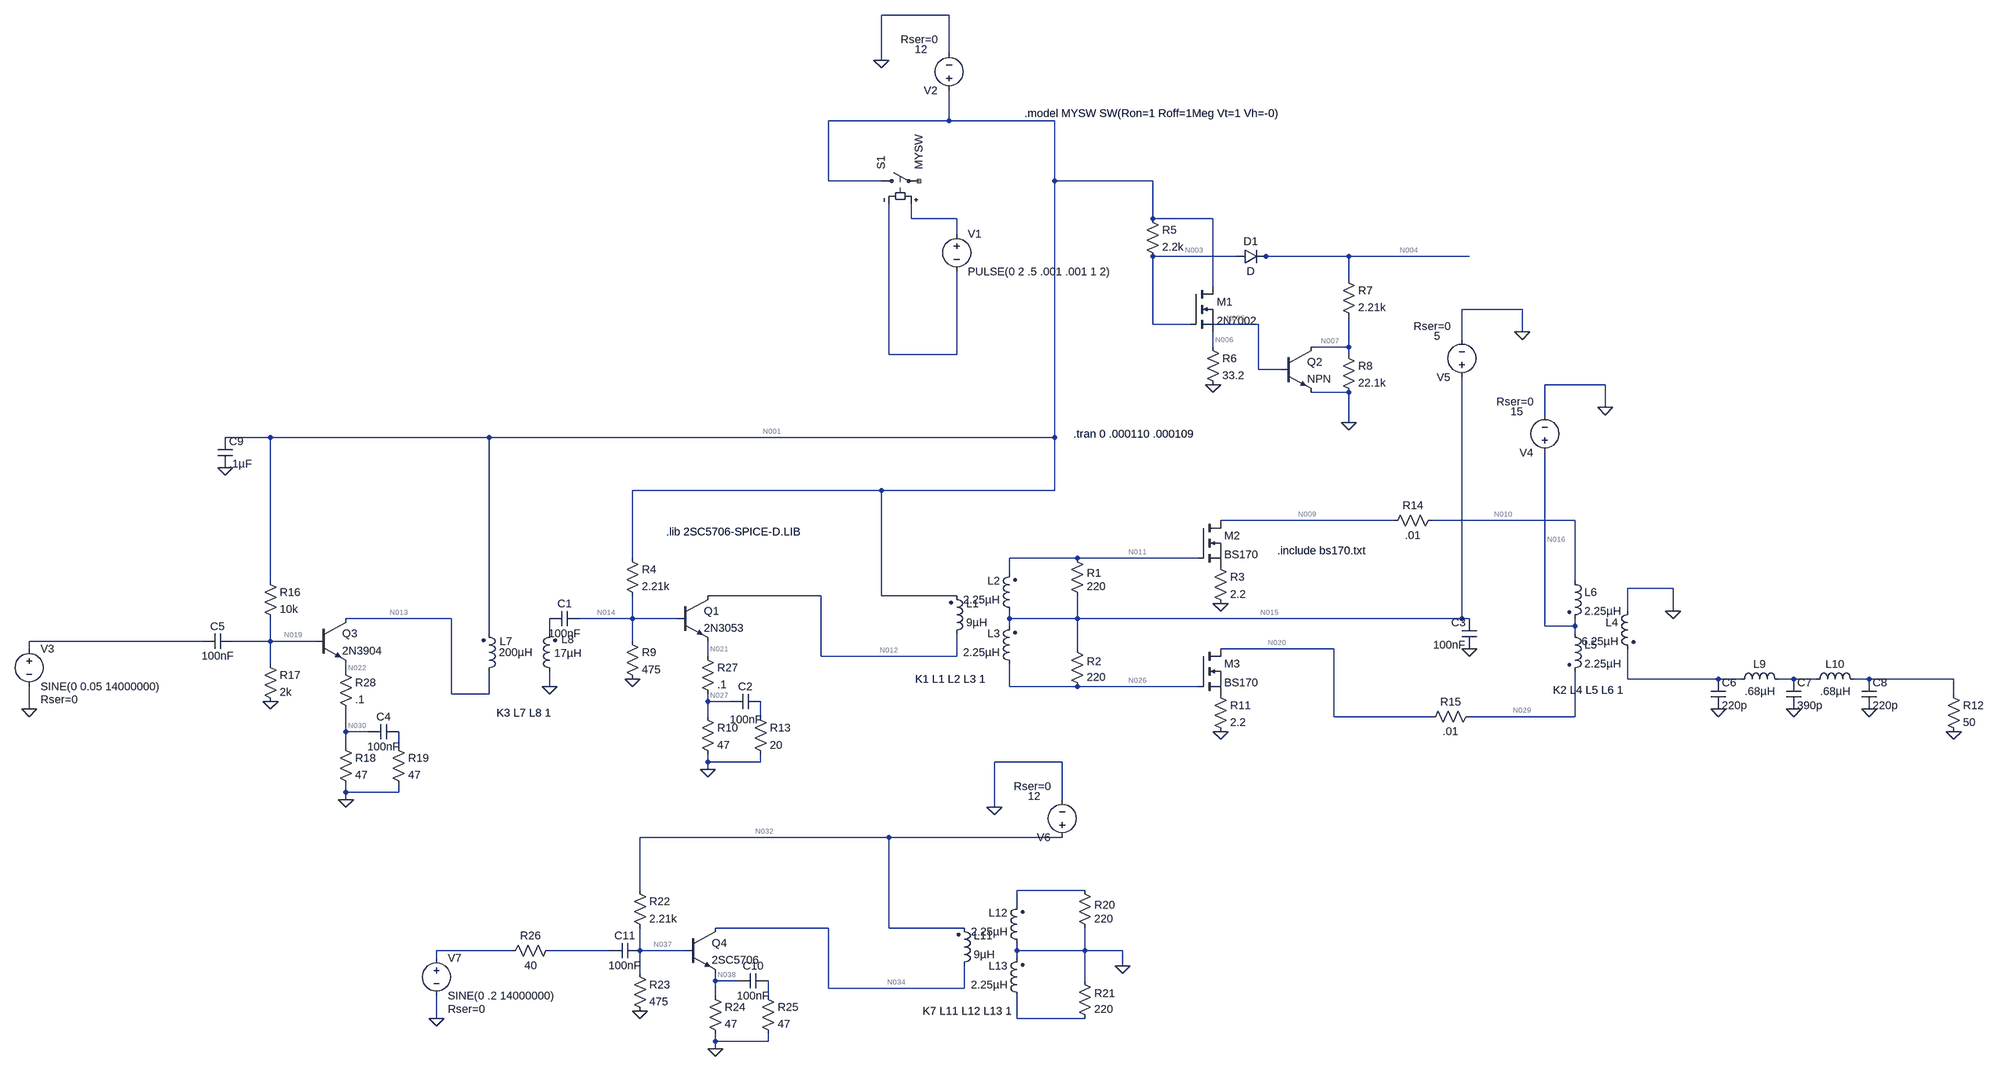
[diagram p0: schematic Transmit Switch Ensemble.asc]
Transmit Switch Ensemble.asc, the LTspice schematic file:
Version 4
SHEET 1 3352 1348
WIRE -416 -992 -560 -992
WIRE -416 -912 -416 -992
WIRE -560 -896 -560 -992
WIRE -416 -768 -416 -832
WIRE -416 -768 -672 -768
WIRE -192 -768 -416 -768
WIRE -672 -640 -672 -768
WIRE -560 -640 -672 -640
WIRE -192 -640 -192 -768
WIRE 16 -640 -192 -640
WIRE -496 -560 -496 -592
WIRE -400 -560 -496 -560
WIRE 16 -560 16 -640
WIRE 144 -560 16 -560
WIRE -400 -528 -400 -560
WIRE 192 -480 16 -480
WIRE 256 -480 240 -480
WIRE 432 -480 256 -480
WIRE 688 -480 432 -480
WIRE 432 -432 432 -480
WIRE 144 -416 144 -560
WIRE 800 -368 672 -368
WIRE 16 -336 16 -480
WIRE 96 -336 16 -336
WIRE 240 -336 144 -336
WIRE 800 -320 800 -368
WIRE 672 -304 672 -368
WIRE 144 -288 144 -320
WIRE 432 -288 432 -352
WIRE 432 -288 352 -288
WIRE -544 -272 -544 -592
WIRE -400 -272 -400 -448
WIRE -400 -272 -544 -272
WIRE 432 -272 432 -288
WIRE 240 -240 240 -336
WIRE 288 -240 240 -240
WIRE 976 -208 848 -208
WIRE 432 -192 352 -192
WIRE 976 -160 976 -208
WIRE 848 -144 848 -208
WIRE 432 -128 432 -192
WIRE -1856 -96 -1952 -96
WIRE -1392 -96 -1856 -96
WIRE -192 -96 -192 -640
WIRE -192 -96 -1392 -96
WIRE -560 16 -1088 16
WIRE -192 16 -192 -96
WIRE -192 16 -560 16
WIRE 528 80 160 80
WIRE 912 80 608 80
WIRE -1088 160 -1088 16
WIRE -144 160 -288 160
WIRE 112 160 -144 160
WIRE -288 192 -288 160
WIRE -1856 208 -1856 -96
WIRE 912 208 912 80
WIRE 1120 224 1024 224
WIRE -688 240 -928 240
WIRE -560 240 -560 16
WIRE -400 240 -560 240
WIRE 1024 272 1024 224
WIRE 1120 272 1120 224
WIRE -1472 288 -1696 288
WIRE -1088 288 -1088 240
WIRE -1088 288 -1200 288
WIRE -992 288 -1088 288
WIRE -288 288 -288 272
WIRE -144 288 -144 240
WIRE -144 288 -288 288
WIRE 672 288 672 -224
WIRE 672 288 -144 288
WIRE 688 288 672 288
WIRE -288 304 -288 288
WIRE 848 304 848 -64
WIRE 912 304 912 288
WIRE 912 304 848 304
WIRE -1392 320 -1392 -96
WIRE -1264 320 -1264 288
WIRE 912 320 912 304
WIRE -2000 336 -2368 336
WIRE -1856 336 -1856 288
WIRE -1856 336 -1936 336
WIRE -1760 336 -1856 336
WIRE -1088 336 -1088 288
WIRE -2368 352 -2368 336
WIRE -144 352 -144 288
WIRE 400 352 160 352
WIRE -928 368 -928 336
WIRE -688 368 -688 240
WIRE -400 368 -400 320
WIRE -400 368 -688 368
WIRE -1856 384 -1856 336
WIRE -1696 400 -1696 384
WIRE 1024 416 1024 352
WIRE 1216 416 1024 416
WIRE 1264 416 1216 416
WIRE 1376 416 1344 416
WIRE 1424 416 1376 416
WIRE 1536 416 1504 416
WIRE 1904 416 1536 416
WIRE -1264 432 -1264 400
WIRE -288 432 -288 384
WIRE -144 432 -288 432
WIRE 112 432 -144 432
WIRE -1472 448 -1472 288
WIRE -1392 448 -1392 400
WIRE -1392 448 -1472 448
WIRE 1904 448 1904 416
WIRE -928 464 -928 448
WIRE -880 464 -928 464
WIRE -2368 480 -2368 432
WIRE -928 496 -928 464
WIRE -816 496 -816 464
WIRE 400 496 400 352
WIRE 608 496 400 496
WIRE 912 496 912 400
WIRE 912 496 688 496
WIRE -1696 528 -1696 480
WIRE -1648 528 -1696 528
WIRE -1696 560 -1696 528
WIRE -1584 560 -1584 528
WIRE -928 592 -928 576
WIRE -816 592 -816 576
WIRE -816 592 -928 592
WIRE -176 592 -320 592
WIRE -928 608 -928 592
WIRE -1696 656 -1696 640
WIRE -1584 656 -1584 640
WIRE -1584 656 -1696 656
WIRE -1696 672 -1696 656
WIRE -176 672 -176 592
WIRE -320 688 -320 592
WIRE -544 752 -1072 752
WIRE -176 752 -544 752
WIRE -1072 896 -1072 752
WIRE -128 896 -272 896
WIRE -272 928 -272 896
WIRE -672 976 -912 976
WIRE -544 976 -544 752
WIRE -384 976 -544 976
WIRE -1344 1024 -1504 1024
WIRE -1136 1024 -1264 1024
WIRE -1072 1024 -1072 976
WIRE -976 1024 -1072 1024
WIRE -272 1024 -272 1008
WIRE -128 1024 -128 976
WIRE -128 1024 -272 1024
WIRE -48 1024 -128 1024
WIRE -1504 1040 -1504 1024
WIRE -272 1040 -272 1024
WIRE -48 1056 -48 1024
WIRE -1072 1072 -1072 1024
WIRE -912 1088 -912 1072
WIRE -864 1088 -912 1088
WIRE -128 1088 -128 1024
WIRE -672 1104 -672 976
WIRE -384 1104 -384 1056
WIRE -384 1104 -672 1104
WIRE -912 1120 -912 1088
WIRE -800 1120 -800 1088
WIRE -1504 1168 -1504 1120
WIRE -272 1168 -272 1120
WIRE -128 1168 -272 1168
WIRE -912 1216 -912 1200
WIRE -800 1216 -800 1200
WIRE -800 1216 -912 1216
WIRE -912 1232 -912 1216
FLAG -560 -896 0
FLAG 144 -208 0
FLAG 432 -128 0
FLAG -2368 480 0
FLAG -1088 416 0
FLAG -928 608 0
FLAG 160 256 0
FLAG 160 528 0
FLAG 1120 272 0
FLAG 1904 528 0
FLAG 976 -160 0
FLAG 688 352 0
FLAG 800 -320 0
FLAG -1856 464 0
FLAG -1696 672 0
FLAG -1264 432 0
FLAG 1216 480 0
FLAG 1376 480 0
FLAG 1536 480 0
FLAG -1952 -32 0
FLAG -1072 1152 0
FLAG -912 1232 0
FLAG -320 688 0
FLAG -1504 1168 0
FLAG -48 1056 0
SYMBOL voltage -416 -816 R180
WINDOW 123 0 0 Left 0
WINDOW 39 24 124 Left 2
WINDOW 3 46 103 Left 2
SYMATTR SpiceLine Rser=0
SYMATTR Value 12
SYMATTR InstName V2
SYMBOL diode 192 -464 R270
WINDOW 0 32 32 VTop 2
WINDOW 3 0 32 VBottom 2
SYMATTR InstName D1
SYMBOL nmos 96 -416 R0
SYMATTR InstName M1
SYMATTR Value 2N7002
SYMBOL res 0 -576 R0
SYMATTR InstName R5
SYMATTR Value 2.2k
SYMBOL res 128 -304 R0
SYMATTR InstName R6
SYMATTR Value 33.2
SYMBOL res 416 -448 R0
SYMATTR InstName R7
SYMATTR Value 2.21k
SYMBOL res 416 -288 R0
SYMATTR InstName R8
SYMATTR Value 22.1k
SYMBOL npn 288 -288 R0
SYMATTR InstName Q2
SYMBOL sw -576 -640 R270
SYMATTR InstName S1
SYMATTR Value MYSW
SYMBOL voltage -400 -544 R0
WINDOW 123 0 0 Left 0
WINDOW 39 0 0 Left 0
SYMATTR InstName V1
SYMATTR Value PULSE(0 2 .5 .001 .001 1 2)
SYMBOL voltage -2368 336 R0
WINDOW 123 0 0 Left 0
WINDOW 39 24 124 Left 2
SYMATTR SpiceLine Rser=0
SYMATTR InstName V3
SYMATTR Value SINE(0 0.05 14000000)
SYMBOL ind2 -416 336 M180
WINDOW 0 36 80 Left 2
WINDOW 3 36 40 Left 2
SYMATTR InstName L1
SYMATTR Value 9µH
SYMATTR Type ind
SYMBOL ind2 -272 288 R180
WINDOW 0 36 80 Left 2
WINDOW 3 36 40 Left 2
SYMATTR InstName L2
SYMATTR Value 2.25µH
SYMATTR Type ind
SYMBOL ind2 -272 400 R180
WINDOW 0 36 80 Left 2
WINDOW 3 36 40 Left 2
SYMATTR InstName L3
SYMATTR Value 2.25µH
SYMATTR Type ind
SYMBOL res -160 144 R0
WINDOW 0 36 47 Left 2
SYMATTR InstName R1
SYMATTR Value 220
SYMBOL res -160 336 R0
WINDOW 0 36 43 Left 2
SYMATTR InstName R2
SYMATTR Value 220
SYMBOL res -1104 144 R0
SYMATTR InstName R4
SYMATTR Value 2.21k
SYMBOL res -1104 320 R0
SYMATTR InstName R9
SYMATTR Value 475
SYMBOL cap -1200 272 R90
WINDOW 0 0 32 VBottom 2
WINDOW 3 32 32 VTop 2
SYMATTR InstName C1
SYMATTR Value 100nF
SYMBOL res -944 480 R0
SYMATTR InstName R10
SYMATTR Value 47
SYMBOL nmos 112 80 R0
SYMATTR InstName M2
SYMATTR Value BS170
SYMATTR Prefix X
SYMBOL nmos 112 352 R0
SYMATTR InstName M3
SYMATTR Value BS170
SYMATTR Prefix X
SYMBOL res 144 160 R0
SYMATTR InstName R3
SYMATTR Value 2.2
SYMBOL res 144 432 R0
SYMATTR InstName R11
SYMATTR Value 2.2
SYMBOL ind2 1040 256 M0
SYMATTR InstName L4
SYMATTR Value 6.25µH
SYMATTR Type ind
SYMBOL ind2 896 304 R0
SYMATTR InstName L5
SYMATTR Value 2.25µH
SYMATTR Type ind
SYMBOL ind2 896 192 R0
SYMATTR InstName L6
SYMATTR Value 2.25µH
SYMATTR Type ind
SYMBOL res 1888 432 R0
SYMATTR InstName R12
SYMATTR Value 50
SYMBOL voltage 848 -48 R180
WINDOW 123 0 0 Left 0
WINDOW 39 24 124 Left 2
WINDOW 3 46 103 Left 2
SYMATTR SpiceLine Rser=0
SYMATTR Value 15
SYMATTR InstName V4
SYMBOL cap 704 352 R180
WINDOW 0 24 56 Left 2
WINDOW 3 24 8 Left 2
SYMATTR InstName C3
SYMATTR Value 100nF
SYMBOL cap -816 448 R90
WINDOW 0 0 32 VBottom 2
WINDOW 3 39 31 VTop 2
SYMATTR InstName C2
SYMATTR Value 100nF
SYMBOL res -832 480 R0
SYMATTR InstName R13
SYMATTR Value 20
SYMBOL voltage 672 -208 R180
WINDOW 123 0 0 Left 0
WINDOW 39 24 124 Left 2
WINDOW 3 46 103 Left 2
SYMATTR SpiceLine Rser=0
SYMATTR Value 5
SYMATTR InstName V5
SYMBOL npn -992 240 R0
SYMATTR InstName Q1
SYMATTR Value 2N3053
SYMBOL res 624 64 R90
WINDOW 0 0 56 VBottom 2
WINDOW 3 32 56 VTop 2
SYMATTR InstName R14
SYMATTR Value .01
SYMBOL res 704 480 R90
WINDOW 0 0 56 VBottom 2
WINDOW 3 32 56 VTop 2
SYMATTR InstName R15
SYMATTR Value .01
SYMBOL res -1872 192 R0
SYMATTR InstName R16
SYMATTR Value 10k
SYMBOL res -1872 368 R0
SYMATTR InstName R17
SYMATTR Value 2k
SYMBOL res -1712 544 R0
SYMATTR InstName R18
SYMATTR Value 47
SYMBOL cap -1584 512 R90
WINDOW 0 0 32 VBottom 2
WINDOW 3 32 32 VTop 2
SYMATTR InstName C4
SYMATTR Value 100nF
SYMBOL res -1600 544 R0
SYMATTR InstName R19
SYMATTR Value 47
SYMBOL npn -1760 288 R0
SYMATTR InstName Q3
SYMATTR Value 2N3904
SYMBOL cap -1936 320 R90
WINDOW 0 0 32 VBottom 2
WINDOW 3 32 32 VTop 2
SYMATTR InstName C5
SYMATTR Value 100nF
SYMBOL ind2 -1408 416 M180
WINDOW 0 38 80 Left 2
WINDOW 3 37 56 Left 2
SYMATTR InstName L7
SYMATTR Value 200µH
SYMATTR Type ind
SYMBOL ind2 -1248 416 R180
WINDOW 0 -36 84 Left 2
WINDOW 3 -52 55 Left 2
SYMATTR InstName L8
SYMATTR Value 17µH
SYMATTR Type ind
SYMBOL cap 1200 416 R0
SYMATTR InstName C6
SYMATTR Value 220p
SYMBOL cap 1360 416 R0
SYMATTR InstName C7
SYMATTR Value 390p
SYMBOL cap 1520 416 R0
SYMATTR InstName C8
SYMATTR Value 220p
SYMBOL ind 1248 432 R270
WINDOW 0 32 56 VTop 2
WINDOW 3 5 56 VBottom 2
SYMATTR InstName L9
SYMATTR Value .68µH
SYMBOL ind 1408 432 R270
WINDOW 0 32 56 VTop 2
WINDOW 3 5 56 VBottom 2
SYMATTR InstName L10
SYMATTR Value .68µH
SYMBOL cap -1968 -96 R0
SYMATTR InstName C9
SYMATTR Value .1µF
SYMBOL ind2 -400 1072 M180
WINDOW 0 36 80 Left 2
WINDOW 3 36 40 Left 2
SYMATTR InstName L11
SYMATTR Value 9µH
SYMATTR Type ind
SYMBOL ind2 -256 1024 R180
WINDOW 0 36 80 Left 2
WINDOW 3 36 40 Left 2
SYMATTR InstName L12
SYMATTR Value 2.25µH
SYMATTR Type ind
SYMBOL ind2 -256 1136 R180
WINDOW 0 36 80 Left 2
WINDOW 3 36 40 Left 2
SYMATTR InstName L13
SYMATTR Value 2.25µH
SYMATTR Type ind
SYMBOL res -144 880 R0
WINDOW 0 36 47 Left 2
SYMATTR InstName R20
SYMATTR Value 220
SYMBOL res -144 1072 R0
WINDOW 0 36 43 Left 2
SYMATTR InstName R21
SYMATTR Value 220
SYMBOL res -1088 880 R0
SYMATTR InstName R22
SYMATTR Value 2.21k
SYMBOL res -1088 1056 R0
SYMATTR InstName R23
SYMATTR Value 475
SYMBOL res -928 1104 R0
SYMATTR InstName R24
SYMATTR Value 47
SYMBOL cap -800 1072 R90
WINDOW 0 0 32 VBottom 2
WINDOW 3 32 32 VTop 2
SYMATTR InstName C10
SYMATTR Value 100nF
SYMBOL res -816 1104 R0
SYMATTR InstName R25
SYMATTR Value 47
SYMBOL npn -976 976 R0
SYMATTR InstName Q4
SYMATTR Value 2SC5706
SYMBOL voltage -176 768 R180
WINDOW 123 0 0 Left 0
WINDOW 39 24 124 Left 2
WINDOW 3 46 103 Left 2
SYMATTR SpiceLine Rser=0
SYMATTR Value 12
SYMATTR InstName V6
SYMBOL voltage -1504 1024 R0
WINDOW 123 0 0 Left 0
WINDOW 39 24 124 Left 2
SYMATTR SpiceLine Rser=0
SYMATTR InstName V7
SYMATTR Value SINE(0 .2 14000000)
SYMBOL cap -1072 1008 R90
WINDOW 0 0 32 VBottom 2
WINDOW 3 32 32 VTop 2
SYMATTR InstName C11
SYMATTR Value 100nF
SYMBOL res -1248 1008 R90
WINDOW 0 0 56 VBottom 2
WINDOW 3 32 56 VTop 2
SYMATTR InstName R26
SYMATTR Value 40
SYMBOL res -944 352 R0
SYMATTR InstName R27
SYMATTR Value .1
SYMBOL res -1712 384 R0
SYMATTR InstName R28
SYMATTR Value .1
TEXT -152 -104 Left 2 !.tran 0 .000110 .000109
TEXT -256 -784 Left 2 !.model MYSW SW(Ron=1 Roff=1Meg Vt=1 Vh=-0)
TEXT -488 416 Left 2 !K1 L1 L2 L3 1
TEXT 1016 440 Right 2 !K2 L4 L5 L6 1
TEXT 280 144 Left 2 !.include bs170.txt
TEXT -1016 104 Left 2 !.lib 2SC5706-SPICE-D.LIB
TEXT -1376 488 Left 2 !K3 L7 L8 1
TEXT -472 1152 Left 2 !K7 L11 L12 L13 1

The netlist it stands for:
* Transmit Switch Ensemble.asc
V2 N001 0 12 Rser=0
D1 N003 N004 D
M1 N001 N003 N006 N006 2N7002
R5 N001 N003 2.2k
R6 N006 0 33.2
R7 N004 N007 2.21k
R8 N007 0 22.1k
Q2 N007 N005 0 0 NPN
S1 N001 NC_01 N002 N008 MYSW
V1 N002 N008 PULSE(0 2 .5 .001 .001 1 2)
V3 N018 0 SINE(0 0.05 14000000) Rser=0
L1 N012 N001 9µH
L2 N015 N011 2.25µH
L3 N026 N015 2.25µH
R1 N011 N015 220
R2 N015 N026 220
R4 N001 N014 2.21k
R9 N014 0 475
C1 N014 N017 100nF
R10 N027 0 47
XM2 N009 N011 P001 BS170  ; pins D G S
XM3 N020 N026 P002 BS170  ; pins D G S
R3 P001 0 2.2
R11 P002 0 2.2
L4 0 N023 6.25µH
L5 N016 N029 2.25µH
L6 N010 N016 2.25µH
R12 N025 0 50
V4 N016 0 15 Rser=0
C3 0 N015 100nF
C2 N028 N027 100nF
R13 N028 0 20
V5 N015 0 5 Rser=0
Q1 N012 N014 N021 0 2N3053
R14 N010 N009 .01
R15 N029 N020 .01
R16 N001 N019 10k
R17 N019 0 2k
R18 N030 0 47
C4 N031 N030 100nF
R19 N031 0 47
Q3 N013 N019 N022 0 2N3904
C5 N019 N018 100nF
L7 N013 N001 200µH
L8 0 N017 17µH
C6 N023 0 220p
C7 N024 0 390p
C8 N025 0 220p
L9 N023 N024 .68µH
L10 N024 N025 .68µH
C9 N001 0 .1µF
L11 N034 N032 9µH
L12 0 N033 2.25µH
L13 N040 0 2.25µH
R20 N033 0 220
R21 0 N040 220
R22 N032 N037 2.21k
R23 N037 0 475
R24 N038 0 47
C10 N039 N038 100nF
R25 N039 0 47
Q4 N034 N037 N038 0 2SC5706
V6 N032 0 12 Rser=0
V7 N035 0 SINE(0 .2 14000000) Rser=0
C11 N037 N036 100nF
R26 N036 N035 40
R27 N021 N027 .1
R28 N022 N030 .1
.model D D
.lib standard.dio
.model NPN NPN
.model PNP PNP
.lib standard.bjt
.model NMOS NMOS
.model PMOS PMOS
.lib standard.mos
.tran 0 .000110 .000109
.model MYSW SW(Ron=1 Roff=1Meg Vt=1 Vh=-0)
K1 L1 L2 L3 1
K2 L4 L5 L6 1
.include bs170.txt
.lib 2SC5706-SPICE-D.LIB
K3 L7 L8 1
K7 L11 L12 L13 1
.backanno
.end

* Results of the author's LTspice run, read from the files saved beside the schematic
* Operating Point, zero values left out:
*   V(n001) = 12 V
*   V(n003) = 11.06 V
*   V(n004) = 10.42 V
*   V(n006) = 7.639 V
*   V(n007) = 9.476 V
*   V(n005) = 413.1 mV
*   V(n012) = 12 V
*   V(n015) = 5 V
*   V(n011) = 5 V
*   V(n026) = 5 V
*   V(n014) = 2.072 V
*   V(n027) = 1.375 V
*   V(p001) = 623.3 mV
*   V(n009) = 15 V
*   V(p002) = 623.3 mV
*   V(n020) = 15 V
*   V(n016) = 15 V
*   V(n029) = 15 V
*   V(n010) = 15 V
*   V(n021) = 1.378 V
*   V(n019) = 1.873 V
*   V(n030) = 1.13 V
*   V(n013) = 12 V
*   V(n022) = 1.132 V
*   V(n034) = 12 V
*   V(n032) = 12 V
*   V(n037) = 2.106 V
*   V(n038) = 1.483 V
*   Ic(Q4) = 31.51 mA
*   Ib(Q4) = 44.2 µA
*   Ie(Q4) = -31.56 mA
*   Ic(Q3) = 23.97 mA
*   Ib(Q3) = 76.49 µA
*   Ie(Q3) = -24.04 mA
*   Ic(Q1) = 29.12 mA
*   Ib(Q1) = 130.9 µA
*   Ie(Q1) = -29.25 mA
*   Ic(Q2) = 874 pA
*   Ie(Q2) = -874 pA
*   Id(M1) = 230.1 mA
*   Is(M1) = -230.1 mA
*   I(D1) = 428.8 µA
*   I(L11) = -31.51 mA
*   I(L7) = -23.97 mA
*   I(L6) = -283.3 mA
*   I(L5) = 283.3 mA
*   I(L1) = -29.12 mA
*   I(R28) = 24.04 mA
*   I(R27) = 29.25 mA
*   I(R24) = 31.56 mA
*   I(R23) = 4.433 mA
*   I(R22) = 4.477 mA
*   I(R18) = 24.04 mA
*   I(R17) = 936.3 µA
*   I(R16) = 1.013 mA
*   I(R15) = 283.3 mA
*   I(R14) = 283.3 mA
*   I(R11) = 283.3 mA
*   I(R3) = 283.3 mA
*   I(R10) = 29.25 mA
*   I(R9) = 4.362 mA
*   I(R4) = 4.492 mA
*   I(R8) = 428.8 µA
*   I(R7) = 428.8 µA
*   I(R6) = 230.1 mA
*   I(R5) = 428.8 µA
*   I(V6) = -35.99 mA
*   I(V4) = -566.6 mA
*   I(V2) = -289.1 mA
*   Ix(m2:1) = 283.3 mA
*   Ix(m2:3) = -283.3 mA
*   Ix(m3:1) = 283.3 mA
*   Ix(m3:3) = -283.3 mA
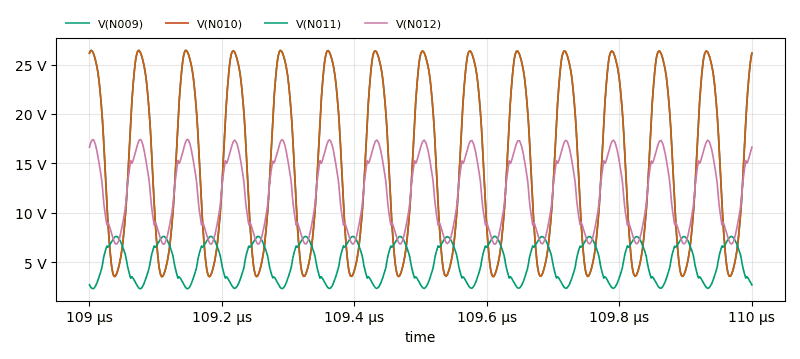
[diagram p1: Transient Analysis of Transmit Switch Ensemble.asc, plotted from the saved traces]
* Transient Analysis, 1 run:
*   V(N009): min 3.515 V, max 26.44 V, average 14.99 V, rms 17.23 V, last 26.16 V
*   V(N010): min 3.521 V, max 26.44 V, average 15 V, rms 17.23 V, last 26.16 V
*   V(N011): min 2.287 V, max 7.6 V, average 5.003 V, rms 5.336 V, last 2.681 V
*   V(N012): min 6.8 V, max 17.43 V, average 11.99 V, rms 12.56 V, last 16.64 V